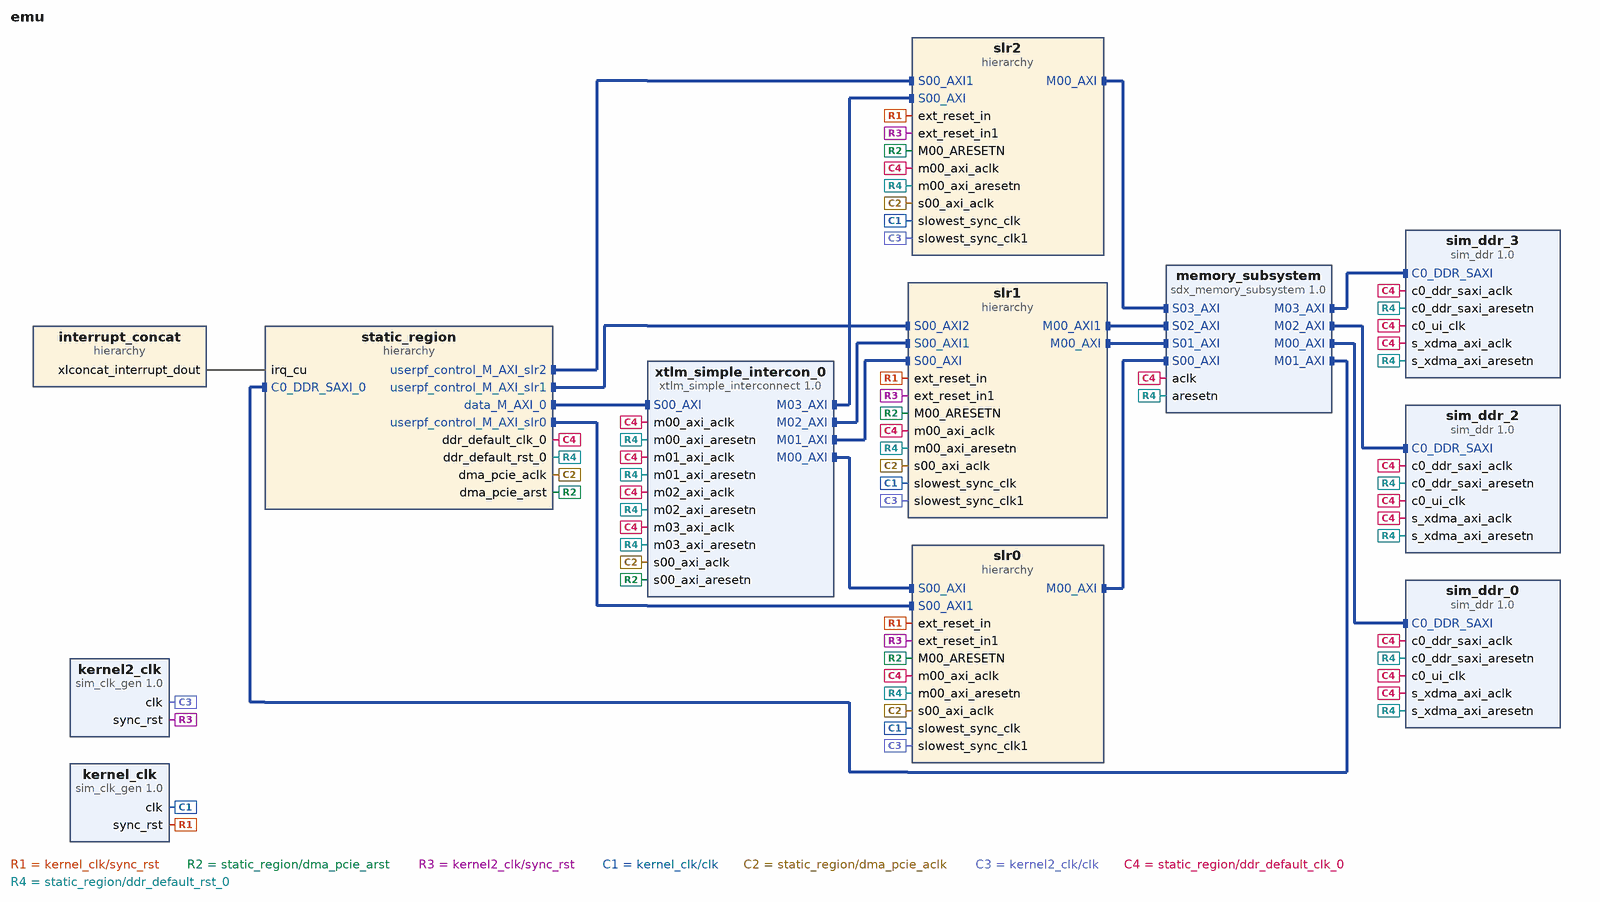
[diagram p0: block diagram of the top level]
# Vivado block design emu, xcu200-fsgd2104-2-e, Vivado 2018.3
create_bd_design emu

create_bd_cell -type hier static_region
create_bd_cell -type ip -vlnv xilinx.com:ip:sim_clk_gen:1.0 kernel2_clk
set_property -dict {CONFIG.FREQ_HZ 500000000} [get_bd_cells kernel2_clk]
create_bd_cell -type ip -vlnv xilinx.com:ip:sim_clk_gen:1.0 kernel_clk
set_property -dict {CONFIG.FREQ_HZ 300000000} [get_bd_cells kernel_clk]
create_bd_cell -type ip -vlnv xilinx.com:xilinx:xtlm_simple_interconnect:1.0 xtlm_simple_intercon_0
set_property -dict [list \
  CONFIG.C_ADDR_RANGES 2 \
  CONFIG.C_M00_A00_ADDR_RANGE {"0000000000000000000000000000001111111111111111111111111111111111"} \
  CONFIG.C_M00_A00_BASE_ADDRESS 0x0 \
  CONFIG.C_M00_A01_ADDR_RANGE 0x0000000000060000 \
  CONFIG.C_M00_A01_BASE_ADDRESS {"0000000000000000000000000001000000000000000000000000000000000000"} \
  CONFIG.C_M00_AXI_ADDR_WIDTH 64 \
  CONFIG.C_M00_AXI_DATA_WIDTH 32 \
  CONFIG.C_M01_A00_ADDR_RANGE {"0000000000000000000000000000001111111111111111111111111111111111"} \
  CONFIG.C_M01_A00_BASE_ADDRESS 0x0000000400000000 \
  CONFIG.C_M01_A01_ADDR_RANGE 0x0000000000060000 \
  CONFIG.C_M01_A01_BASE_ADDRESS {"0000000000000000000000000001000000000000000000000000000000000000"} \
  CONFIG.C_M01_AXI_ADDR_WIDTH 64 \
  CONFIG.C_M01_AXI_DATA_WIDTH 32 \
  CONFIG.C_M02_A00_ADDR_RANGE {"0000000000000000000000000000001111111111111111111111111111111111"} \
  CONFIG.C_M02_A00_BASE_ADDRESS 0x0000000800000000 \
  CONFIG.C_M02_A01_ADDR_RANGE 0x0000000000060000 \
  CONFIG.C_M02_A01_BASE_ADDRESS {"0000000000000000000000000001000000000000000000000000000000000000"} \
  CONFIG.C_M02_AXI_ADDR_WIDTH 64 \
  CONFIG.C_M02_AXI_DATA_WIDTH 32 \
  CONFIG.C_M03_A00_ADDR_RANGE {"0000000000000000000000000000001111111111111111111111111111111111"} \
  CONFIG.C_M03_A00_BASE_ADDRESS 0x0000000C00000000 \
  CONFIG.C_M03_A01_ADDR_RANGE 0x0000000000060000 \
  CONFIG.C_M03_A01_BASE_ADDRESS {"0000000000000000000000000001000000000000000000000000000000000000"} \
  CONFIG.C_M03_AXI_ADDR_WIDTH 64 \
  CONFIG.C_M03_AXI_DATA_WIDTH 32 \
  CONFIG.C_NUM_MI 4 \
  CONFIG.C_S00_AXI_ADDR_WIDTH 64 \
  CONFIG.C_S00_AXI_DATA_WIDTH 32 \
] [get_bd_cells xtlm_simple_intercon_0]
create_bd_cell -type ip -vlnv xilinx.com:ip:sdx_memory_subsystem:1.0 memory_subsystem
set_property -dict [list \
  CONFIG.ADVANCED_PROPERTIES {resource_map_replication {S00_AXI {} S01_AXI {} S02_AXI {} S03_AXI {}} plram_specifications {{ SIZE 128K AXI_DATA_WIDTH 512 SLR_ASSIGNMENT SLR0 } { SIZE 128K AXI_DATA_WIDTH 512 SLR_ASSIGNMENT SLR1 } { SIZE 128K AXI_DATA_WIDTH 512 SLR_ASSIGNMENT SLR2 }} resource_access_constraints {S00_AXI {M00_AXI_MEM00 PLRAM_MEM00 PLRAM_MEM01 PLRAM_MEM02} S01_AXI M01_AXI_MEM00 S02_AXI M02_AXI_MEM00 S03_AXI M03_AXI_MEM00} __temp_dsa_info {excluded_board_components {xilinx.com:au200:ddr4_sdram_c0:1.0 xilinx.com:au200:ddr4_sdram_c1:1.0 xilinx.com:au200:ddr4_sdram_c2:1.0 xilinx.com:au200:ddr4_sdram_c3:1.0} axi_passthrough {xilinx.com:au200:ddr4_sdram_c0:1.0 {offset 0x0 range 16G slr SLR0} xilinx.com:au200:ddr4_sdram_c1:1.0 {offset 0x400000000 range 16G slr SLR1} xilinx.com:au200:ddr4_sdram_c2:1.0 {offset 0x800000000 range 16G slr SLR1} xilinx.com:au200:ddr4_sdram_c3:1.0 {offset 0xc00000000 range 16G slr SLR2}} sim_props {ddr4_0 {offset 0x0 range 0x400000000 slr SLR0 passthrough yes} ddr4_1 {offset 0x400000000 range 0x400000000 slr SLR1 passthrough yes} ddr4_2 {offset 0x800000000 range 0x400000000 slr SLR1 passthrough yes} ddr4_3 {offset 0xc00000000 range 0x400000000 slr SLR2 passthrough yes} plram_0 {offset 0x1000000000 range 0x20000 slr SLR0 passthrough no} plram_1 {offset 0x1000020000 range 0x20000 slr SLR1 passthrough no} plram_2 {offset 0x1000040000 range 0x20000 slr SLR2 passthrough no}}}} \
  CONFIG.NUM_CLKS 1 \
  CONFIG.NUM_SI 4 \
] [get_bd_cells memory_subsystem]
create_bd_cell -type ip -vlnv xilinx.com:user:sim_ddr:1.0 sim_ddr_0
set_property -dict [list \
  CONFIG.C0_A00_BASE_ADDR 0x0 \
  CONFIG.C0_A00_HIGH_ADDR 0x0000000400000000 \
  CONFIG.C0_ADDR_WIDTH 17 \
  CONFIG.C0_APP_ADDR_WIDTH 31 \
  CONFIG.C0_APP_DATA_WIDTH 512 \
  CONFIG.C0_AXI_ADDR_WIDTH 34 \
  CONFIG.C0_AXI_ARBITRATION_SCHEME RD_PRI_REG \
  CONFIG.C0_AXI_DATA_WIDTH 512 \
  CONFIG.C0_AXI_ID_WIDTH 1 \
  CONFIG.C0_AutoPrecharge false \
  CONFIG.C0_AxiNarrowBurst false \
  CONFIG.C0_BANK_GROUP_WIDTH 2 \
  CONFIG.C0_BANK_WIDTH 2 \
  CONFIG.C0_BURST_LENGTH 8 \
  CONFIG.C0_CL 0 \
  CONFIG.C0_COLUMN_WIDTH 10 \
  CONFIG.C0_CWL 0 \
  CONFIG.C0_DATA_WIDTH 72 \
  CONFIG.C0_DDR_SAXI_ADDR_WIDTH 34 \
  CONFIG.C0_DDR_SAXI_BASEADDR 0x0000000000000000 \
  CONFIG.C0_DDR_SAXI_DATA_WIDTH 512 \
  CONFIG.C0_DDR_SAXI_HIGHADDR 0x0000000400000000 \
  CONFIG.C0_MEMORY_PART MTA18ASF2G72PZ-2G3 \
  CONFIG.C0_MEM_ADDR_MAP ROW_COLUMN_BANK \
  CONFIG.C0_Mem_Add_Map ROW_COLUMN_BANK \
  CONFIG.C0_NAME dynamic_region_memory_subsystem_memory_ddr4_mem00 \
  CONFIG.C0_Ordering Normal \
  CONFIG.C0_RANK_WIDTH 1 \
  CONFIG.C0_ROW_WIDTH 17 \
  CONFIG.C0_SIZE 16GB \
  CONFIG.C0_TIMEPERIOD_PS 833 \
  CONFIG.C0_TYPE ddr4 \
  CONFIG.C0_tCK 833 \
  CONFIG.C0_tCKE 0 \
  CONFIG.C0_tFAW 16 \
  CONFIG.C0_tMRD 2 \
  CONFIG.C0_tRAS 39 \
  CONFIG.C0_tRCD 17 \
  CONFIG.C0_tREFI 9363 \
  CONFIG.C0_tRFC 421 \
  CONFIG.C0_tRP 17 \
  CONFIG.C0_tRRD_L 6 \
  CONFIG.C0_tRRD_S 4 \
  CONFIG.C0_tRTP 10 \
  CONFIG.C0_tWR 19 \
  CONFIG.C0_tWTR_L 10 \
  CONFIG.C0_tWTR_S 4 \
  CONFIG.C0_tXPR 109 \
  CONFIG.C0_tZQCS 128 \
  CONFIG.C0_tZQI 0 \
  CONFIG.C0_tZQINIT 256 \
  CONFIG.C_NUMBER_OF_GLOBAL_MEMORIES 1 \
] [get_bd_cells sim_ddr_0]
create_bd_cell -type ip -vlnv xilinx.com:user:sim_ddr:1.0 sim_ddr_2
set_property -dict [list \
  CONFIG.C0_A00_BASE_ADDR 0x0 \
  CONFIG.C0_A00_HIGH_ADDR 0x0000000400000000 \
  CONFIG.C0_ADDR_WIDTH 17 \
  CONFIG.C0_APP_ADDR_WIDTH 31 \
  CONFIG.C0_APP_DATA_WIDTH 512 \
  CONFIG.C0_AXI_ADDR_WIDTH 34 \
  CONFIG.C0_AXI_ARBITRATION_SCHEME RD_PRI_REG \
  CONFIG.C0_AXI_DATA_WIDTH 512 \
  CONFIG.C0_AXI_ID_WIDTH 1 \
  CONFIG.C0_AutoPrecharge false \
  CONFIG.C0_AxiNarrowBurst false \
  CONFIG.C0_BANK_GROUP_WIDTH 2 \
  CONFIG.C0_BANK_WIDTH 2 \
  CONFIG.C0_BURST_LENGTH 8 \
  CONFIG.C0_CL 0 \
  CONFIG.C0_COLUMN_WIDTH 10 \
  CONFIG.C0_CWL 0 \
  CONFIG.C0_DATA_WIDTH 72 \
  CONFIG.C0_DDR_SAXI_ADDR_WIDTH 34 \
  CONFIG.C0_DDR_SAXI_BASEADDR 0x0000000000000000 \
  CONFIG.C0_DDR_SAXI_DATA_WIDTH 512 \
  CONFIG.C0_DDR_SAXI_HIGHADDR 0x0000000400000000 \
  CONFIG.C0_MEMORY_PART MTA18ASF2G72PZ-2G3 \
  CONFIG.C0_MEM_ADDR_MAP ROW_COLUMN_BANK \
  CONFIG.C0_Mem_Add_Map ROW_COLUMN_BANK \
  CONFIG.C0_NAME dynamic_region_memory_subsystem_memory_ddr4_mem01 \
  CONFIG.C0_Ordering Normal \
  CONFIG.C0_RANK_WIDTH 1 \
  CONFIG.C0_ROW_WIDTH 17 \
  CONFIG.C0_SIZE 16GB \
  CONFIG.C0_TIMEPERIOD_PS 833 \
  CONFIG.C0_TYPE ddr4 \
  CONFIG.C0_tCK 833 \
  CONFIG.C0_tCKE 0 \
  CONFIG.C0_tFAW 16 \
  CONFIG.C0_tMRD 2 \
  CONFIG.C0_tRAS 39 \
  CONFIG.C0_tRCD 17 \
  CONFIG.C0_tREFI 9363 \
  CONFIG.C0_tRFC 421 \
  CONFIG.C0_tRP 17 \
  CONFIG.C0_tRRD_L 6 \
  CONFIG.C0_tRRD_S 4 \
  CONFIG.C0_tRTP 10 \
  CONFIG.C0_tWR 19 \
  CONFIG.C0_tWTR_L 10 \
  CONFIG.C0_tWTR_S 4 \
  CONFIG.C0_tXPR 109 \
  CONFIG.C0_tZQCS 128 \
  CONFIG.C0_tZQI 0 \
  CONFIG.C0_tZQINIT 256 \
  CONFIG.C_NUMBER_OF_GLOBAL_MEMORIES 1 \
] [get_bd_cells sim_ddr_2]
create_bd_cell -type ip -vlnv xilinx.com:user:sim_ddr:1.0 sim_ddr_3
set_property -dict [list \
  CONFIG.C0_A00_BASE_ADDR 0x0 \
  CONFIG.C0_A00_HIGH_ADDR 0x0000000400000000 \
  CONFIG.C0_ADDR_WIDTH 17 \
  CONFIG.C0_APP_ADDR_WIDTH 31 \
  CONFIG.C0_APP_DATA_WIDTH 512 \
  CONFIG.C0_AXI_ADDR_WIDTH 34 \
  CONFIG.C0_AXI_ARBITRATION_SCHEME RD_PRI_REG \
  CONFIG.C0_AXI_DATA_WIDTH 512 \
  CONFIG.C0_AXI_ID_WIDTH 1 \
  CONFIG.C0_AutoPrecharge false \
  CONFIG.C0_AxiNarrowBurst false \
  CONFIG.C0_BANK_GROUP_WIDTH 2 \
  CONFIG.C0_BANK_WIDTH 2 \
  CONFIG.C0_BURST_LENGTH 8 \
  CONFIG.C0_CL 0 \
  CONFIG.C0_COLUMN_WIDTH 10 \
  CONFIG.C0_CWL 0 \
  CONFIG.C0_DATA_WIDTH 72 \
  CONFIG.C0_DDR_SAXI_ADDR_WIDTH 34 \
  CONFIG.C0_DDR_SAXI_BASEADDR 0x0000000000000000 \
  CONFIG.C0_DDR_SAXI_DATA_WIDTH 512 \
  CONFIG.C0_DDR_SAXI_HIGHADDR 0x0000000400000000 \
  CONFIG.C0_MEMORY_PART MTA18ASF2G72PZ-2G3 \
  CONFIG.C0_MEM_ADDR_MAP ROW_COLUMN_BANK \
  CONFIG.C0_Mem_Add_Map ROW_COLUMN_BANK \
  CONFIG.C0_NAME dynamic_region_memory_subsystem_memory_ddr4_mem02 \
  CONFIG.C0_Ordering Normal \
  CONFIG.C0_RANK_WIDTH 1 \
  CONFIG.C0_ROW_WIDTH 17 \
  CONFIG.C0_SIZE 16GB \
  CONFIG.C0_TIMEPERIOD_PS 833 \
  CONFIG.C0_TYPE ddr4 \
  CONFIG.C0_tCK 833 \
  CONFIG.C0_tCKE 0 \
  CONFIG.C0_tFAW 16 \
  CONFIG.C0_tMRD 2 \
  CONFIG.C0_tRAS 39 \
  CONFIG.C0_tRCD 17 \
  CONFIG.C0_tREFI 9363 \
  CONFIG.C0_tRFC 421 \
  CONFIG.C0_tRP 17 \
  CONFIG.C0_tRRD_L 6 \
  CONFIG.C0_tRRD_S 4 \
  CONFIG.C0_tRTP 10 \
  CONFIG.C0_tWR 19 \
  CONFIG.C0_tWTR_L 10 \
  CONFIG.C0_tWTR_S 4 \
  CONFIG.C0_tXPR 109 \
  CONFIG.C0_tZQCS 128 \
  CONFIG.C0_tZQI 0 \
  CONFIG.C0_tZQINIT 256 \
  CONFIG.C_NUMBER_OF_GLOBAL_MEMORIES 1 \
] [get_bd_cells sim_ddr_3]
create_bd_cell -type hier slr0
create_bd_cell -type hier slr1
create_bd_cell -type hier slr2
create_bd_cell -type hier interrupt_concat

# ---- hierarchy /static_region ----
current_bd_instance /static_region
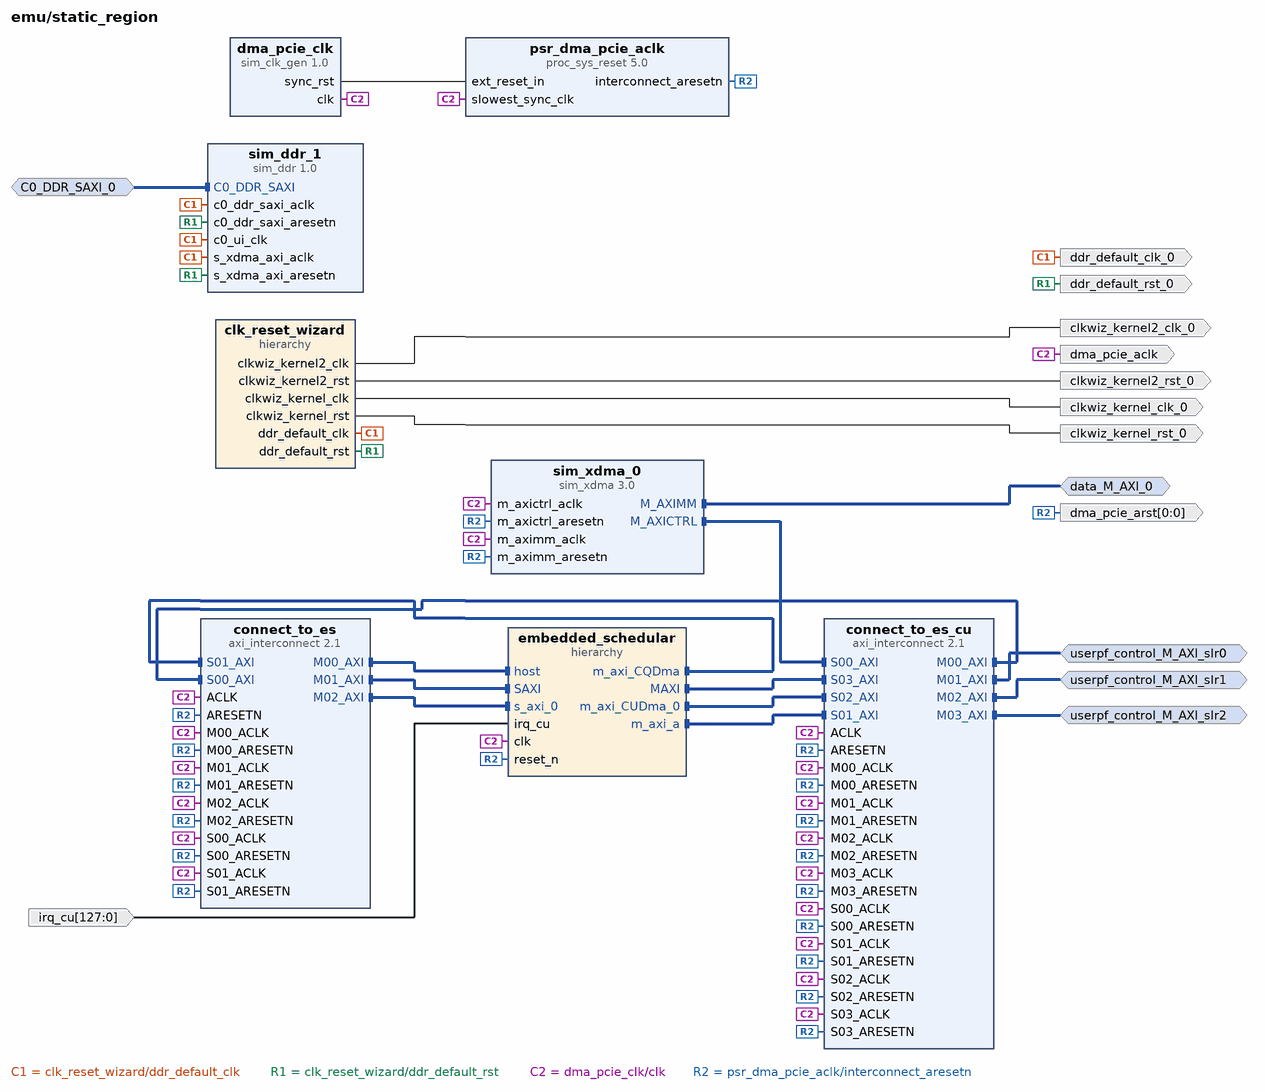
[diagram p1: block diagram inside /static_region]
create_bd_intf_pin -mode Slave -vlnv xilinx.com:interface:aximm_rtl:1.0 C0_DDR_SAXI_0
create_bd_intf_pin -mode Master -vlnv xilinx.com:interface:aximm_rtl:1.0 data_M_AXI_0
create_bd_intf_pin -mode Master -vlnv xilinx.com:interface:aximm_rtl:1.0 userpf_control_M_AXI_slr0
create_bd_intf_pin -mode Master -vlnv xilinx.com:interface:aximm_rtl:1.0 userpf_control_M_AXI_slr1
create_bd_intf_pin -mode Master -vlnv xilinx.com:interface:aximm_rtl:1.0 userpf_control_M_AXI_slr2
create_bd_pin -dir O -type clk clkwiz_kernel2_clk_0
create_bd_pin -dir O -type clk clkwiz_kernel_clk_0
create_bd_pin -dir O -type rst clkwiz_kernel2_rst_0
create_bd_pin -dir O -type rst clkwiz_kernel_rst_0
create_bd_pin -dir O -type clk ddr_default_clk_0
create_bd_pin -dir O -type rst ddr_default_rst_0
create_bd_pin -dir O -type clk dma_pcie_aclk
create_bd_pin -dir I -from 127 -to 0 irq_cu
create_bd_pin -dir O -from 0 -to 0 -type rst dma_pcie_arst

create_bd_cell -type hier clk_reset_wizard
create_bd_cell -type ip -vlnv xilinx.com:ip:axi_interconnect:2.1 connect_to_es
set_property -dict {CONFIG.NUM_MI 3 CONFIG.NUM_SI 2} [get_bd_cells connect_to_es]
create_bd_cell -type ip -vlnv xilinx.com:ip:axi_interconnect:2.1 connect_to_es_cu
set_property -dict {CONFIG.NUM_MI 4 CONFIG.NUM_SI 4} [get_bd_cells connect_to_es_cu]
create_bd_cell -type ip -vlnv xilinx.com:ip:sim_clk_gen:1.0 dma_pcie_clk
set_property -dict {CONFIG.FREQ_HZ 300000000.0} [get_bd_cells dma_pcie_clk]
create_bd_cell -type hier embedded_schedular
create_bd_cell -type ip -vlnv xilinx.com:ip:proc_sys_reset:5.0 psr_dma_pcie_aclk
create_bd_cell -type ip -vlnv xilinx.com:user:sim_ddr:1.0 sim_ddr_1
set_property -dict [list \
  CONFIG.C0_A00_BASE_ADDR 0x0 \
  CONFIG.C0_A00_HIGH_ADDR 0x0000000400000000 \
  CONFIG.C0_ADDR_WIDTH 17 \
  CONFIG.C0_APP_ADDR_WIDTH 31 \
  CONFIG.C0_APP_DATA_WIDTH 512 \
  CONFIG.C0_AXI_ADDR_WIDTH 34 \
  CONFIG.C0_AXI_ARBITRATION_SCHEME RD_PRI_REG \
  CONFIG.C0_AXI_DATA_WIDTH 512 \
  CONFIG.C0_AXI_ID_WIDTH 1 \
  CONFIG.C0_AutoPrecharge false \
  CONFIG.C0_AxiNarrowBurst false \
  CONFIG.C0_BANK_GROUP_WIDTH 2 \
  CONFIG.C0_BANK_WIDTH 2 \
  CONFIG.C0_BURST_LENGTH 8 \
  CONFIG.C0_CL 0 \
  CONFIG.C0_COLUMN_WIDTH 10 \
  CONFIG.C0_CWL 0 \
  CONFIG.C0_DATA_WIDTH 72 \
  CONFIG.C0_DDR_SAXI_ADDR_WIDTH 34 \
  CONFIG.C0_DDR_SAXI_BASEADDR 0x0000000000000000 \
  CONFIG.C0_DDR_SAXI_DATA_WIDTH 512 \
  CONFIG.C0_DDR_SAXI_HIGHADDR 0x0000000400000000 \
  CONFIG.C0_MEMORY_PART MTA18ASF2G72PZ-2G3 \
  CONFIG.C0_MEM_ADDR_MAP ROW_COLUMN_BANK \
  CONFIG.C0_Mem_Add_Map ROW_COLUMN_BANK \
  CONFIG.C0_NAME static_region_slr1_memc_ddrmem_1 \
  CONFIG.C0_Ordering Normal \
  CONFIG.C0_RANK_WIDTH 1 \
  CONFIG.C0_ROW_WIDTH 17 \
  CONFIG.C0_SIZE 16GB \
  CONFIG.C0_TIMEPERIOD_PS 833 \
  CONFIG.C0_TYPE ddr4 \
  CONFIG.C0_tCK 833 \
  CONFIG.C0_tCKE 0 \
  CONFIG.C0_tFAW 16 \
  CONFIG.C0_tMRD 2 \
  CONFIG.C0_tRAS 39 \
  CONFIG.C0_tRCD 17 \
  CONFIG.C0_tREFI 9363 \
  CONFIG.C0_tRFC 421 \
  CONFIG.C0_tRP 17 \
  CONFIG.C0_tRRD_L 6 \
  CONFIG.C0_tRRD_S 4 \
  CONFIG.C0_tRTP 10 \
  CONFIG.C0_tWR 19 \
  CONFIG.C0_tWTR_L 10 \
  CONFIG.C0_tWTR_S 4 \
  CONFIG.C0_tXPR 109 \
  CONFIG.C0_tZQCS 128 \
  CONFIG.C0_tZQI 0 \
  CONFIG.C0_tZQINIT 256 \
  CONFIG.C_NUMBER_OF_GLOBAL_MEMORIES 1 \
] [get_bd_cells sim_ddr_1]
create_bd_cell -type ip -vlnv xilinx.com:xilinx:sim_xdma:3.0 sim_xdma_0
set_property -dict [list \
  CONFIG.C_M_AXICTRL_ADDR_WIDTH 64 \
  CONFIG.C_M_AXICTRL_DATA_WIDTH 32 \
  CONFIG.C_M_AXIMM_ADDR_WIDTH 64 \
  CONFIG.C_M_AXIMM_ARUSER_WIDTH 32 \
  CONFIG.C_M_AXIMM_AWUSER_WIDTH 32 \
  CONFIG.C_M_AXIMM_DATA_WIDTH 32 \
] [get_bd_cells sim_xdma_0]

# ---- hierarchy /static_region/clk_reset_wizard ----
current_bd_instance /static_region/clk_reset_wizard
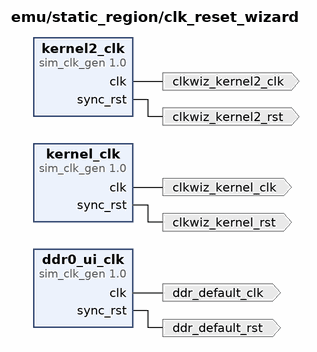
[diagram p2: block diagram inside /static_region/clk_reset_wizard]
create_bd_pin -dir O -type rst clkwiz_kernel2_rst
create_bd_pin -dir O -type rst clkwiz_kernel_rst
create_bd_pin -dir O -type clk ddr_default_clk
create_bd_pin -dir O -type rst ddr_default_rst
create_bd_pin -dir O -type clk clkwiz_kernel2_clk
create_bd_pin -dir O -type clk clkwiz_kernel_clk

create_bd_cell -type ip -vlnv xilinx.com:ip:sim_clk_gen:1.0 ddr0_ui_clk
set_property -dict {CONFIG.FREQ_HZ 300120048} [get_bd_cells ddr0_ui_clk]
create_bd_cell -type ip -vlnv xilinx.com:ip:sim_clk_gen:1.0 kernel2_clk
set_property -dict {CONFIG.FREQ_HZ 500000000} [get_bd_cells kernel2_clk]
create_bd_cell -type ip -vlnv xilinx.com:ip:sim_clk_gen:1.0 kernel_clk
set_property -dict {CONFIG.FREQ_HZ 300000000} [get_bd_cells kernel_clk]

# ---- hierarchy /static_region/embedded_schedular ----
current_bd_instance /static_region/embedded_schedular
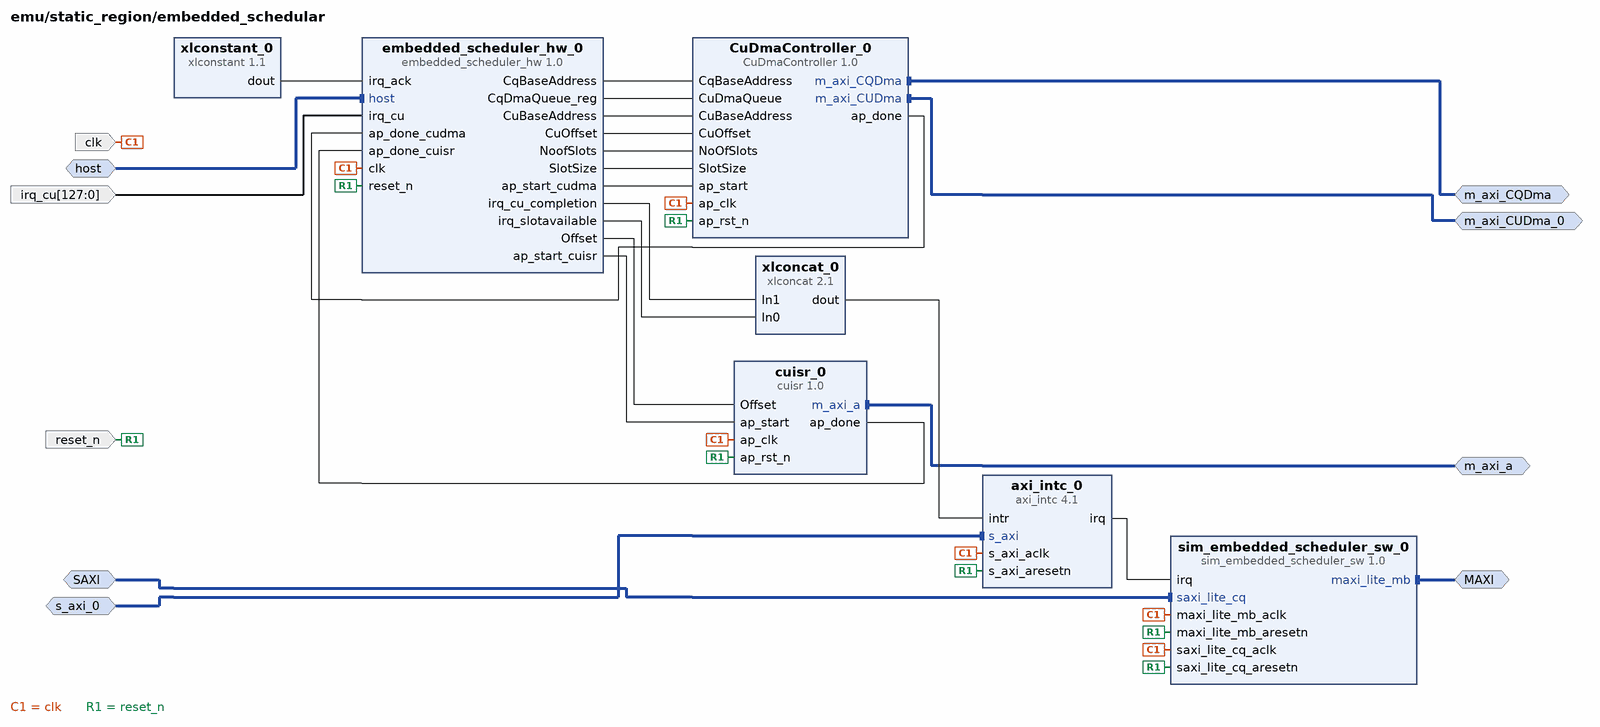
[diagram p3: block diagram inside /static_region/embedded_schedular]
create_bd_intf_pin -mode Master -vlnv xilinx.com:interface:aximm_rtl:1.0 MAXI
create_bd_intf_pin -mode Slave -vlnv xilinx.com:interface:aximm_rtl:1.0 SAXI
create_bd_intf_pin -mode Slave -vlnv xilinx.com:interface:aximm_rtl:1.0 host
create_bd_intf_pin -mode Master -vlnv xilinx.com:interface:aximm_rtl:1.0 m_axi_CQDma
create_bd_intf_pin -mode Master -vlnv xilinx.com:interface:aximm_rtl:1.0 m_axi_CUDma_0
create_bd_intf_pin -mode Master -vlnv xilinx.com:interface:aximm_rtl:1.0 m_axi_a
create_bd_intf_pin -mode Slave -vlnv xilinx.com:interface:aximm_rtl:1.0 s_axi_0
create_bd_pin -dir I -type clk clk
create_bd_pin -dir I -from 127 -to 0 irq_cu
create_bd_pin -dir I -type rst reset_n

create_bd_cell -type ip -vlnv xilinx:hls:CuDmaController:1.0 CuDmaController_0
create_bd_cell -type ip -vlnv xilinx.com:ip:axi_intc:4.1 axi_intc_0
set_property -dict [list \
  CONFIG.C_HAS_FAST 0 \
  CONFIG.C_IRQ_ACTIVE 1 \
  CONFIG.C_IRQ_IS_LEVEL 1 \
  CONFIG.C_KIND_OF_INTR 0xFFFFFFFC \
  CONFIG.C_KIND_OF_LVL 0xFFFFFFFF \
] [get_bd_cells axi_intc_0]
create_bd_cell -type ip -vlnv xilinx:hls:cuisr:1.0 cuisr_0
create_bd_cell -type ip -vlnv xilinx.com:user:embedded_scheduler_hw:1.0 embedded_scheduler_hw_0
create_bd_cell -type ip -vlnv xilinx.com:xilinx:sim_embedded_scheduler_sw:1.0 sim_embedded_scheduler_sw_0
create_bd_cell -type ip -vlnv xilinx.com:ip:xlconcat:2.1 xlconcat_0
create_bd_cell -type ip -vlnv xilinx.com:ip:xlconstant:1.1 xlconstant_0
set_property -dict {CONFIG.CONST_VAL 0 CONFIG.CONST_WIDTH 16} [get_bd_cells xlconstant_0]

# ---- hierarchy /slr0 ----
current_bd_instance /slr0
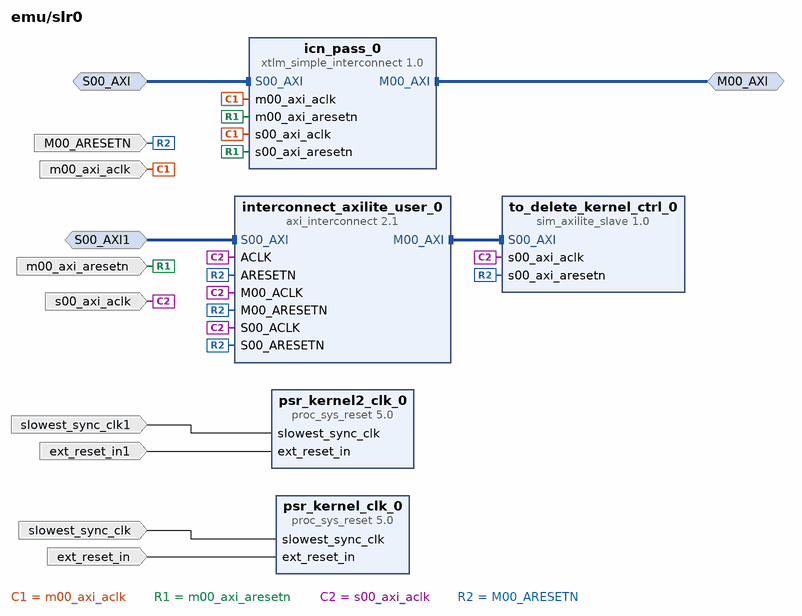
[diagram p4: block diagram inside /slr0]
create_bd_intf_pin -mode Slave -vlnv xilinx.com:interface:aximm_rtl:1.0 S00_AXI
create_bd_intf_pin -mode Master -vlnv xilinx.com:interface:aximm_rtl:1.0 M00_AXI
create_bd_intf_pin -mode Slave -vlnv xilinx.com:interface:aximm_rtl:1.0 S00_AXI1
create_bd_pin -dir I -type clk m00_axi_aclk
create_bd_pin -dir I -type rst m00_axi_aresetn
create_bd_pin -dir I -type clk slowest_sync_clk
create_bd_pin -dir I -type rst ext_reset_in
create_bd_pin -dir I -type clk slowest_sync_clk1
create_bd_pin -dir I -type rst ext_reset_in1
create_bd_pin -dir I -type clk s00_axi_aclk
create_bd_pin -dir I -type rst M00_ARESETN

create_bd_cell -type ip -vlnv xilinx.com:xilinx:xtlm_simple_interconnect:1.0 icn_pass_0
set_property -dict [list \
  CONFIG.C_M00_AXI_ADDR_WIDTH 64 \
  CONFIG.C_NUM_MI 1 \
  CONFIG.C_NUM_SI 1 \
  CONFIG.SLR_ASSIGNMENTS SLR0 \
] [get_bd_cells icn_pass_0]
create_bd_cell -type ip -vlnv xilinx.com:ip:proc_sys_reset:5.0 psr_kernel_clk_0
set_property -dict {CONFIG.SLR_ASSIGNMENTS SLR0} [get_bd_cells psr_kernel_clk_0]
create_bd_cell -type ip -vlnv xilinx.com:ip:proc_sys_reset:5.0 psr_kernel2_clk_0
set_property -dict {CONFIG.SLR_ASSIGNMENTS SLR0} [get_bd_cells psr_kernel2_clk_0]
create_bd_cell -type ip -vlnv xilinx.com:ip:axi_interconnect:2.1 interconnect_axilite_user_0
set_property -dict [list \
  CONFIG.M01_HAS_REGSLICE 1 \
  CONFIG.NUM_MI 1 \
  CONFIG.NUM_SI 1 \
  CONFIG.SLR_ASSIGNMENTS SLR0 \
] [get_bd_cells interconnect_axilite_user_0]
create_bd_cell -type ip -vlnv xilinx.com:user:sim_axilite_slave:1.0 to_delete_kernel_ctrl_0
set_property -dict {CONFIG.SLR_ASSIGNMENTS SLR0} [get_bd_cells to_delete_kernel_ctrl_0]

# ---- hierarchy /slr1 ----
current_bd_instance /slr1
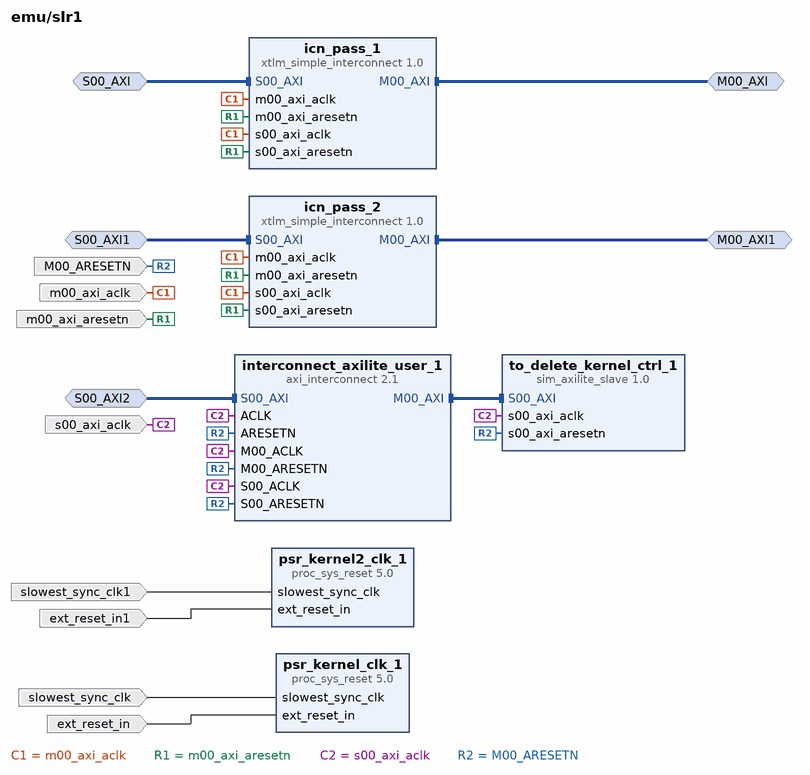
[diagram p5: block diagram inside /slr1]
create_bd_intf_pin -mode Slave -vlnv xilinx.com:interface:aximm_rtl:1.0 S00_AXI
create_bd_intf_pin -mode Master -vlnv xilinx.com:interface:aximm_rtl:1.0 M00_AXI
create_bd_intf_pin -mode Slave -vlnv xilinx.com:interface:aximm_rtl:1.0 S00_AXI1
create_bd_intf_pin -mode Master -vlnv xilinx.com:interface:aximm_rtl:1.0 M00_AXI1
create_bd_intf_pin -mode Slave -vlnv xilinx.com:interface:aximm_rtl:1.0 S00_AXI2
create_bd_pin -dir I -type clk m00_axi_aclk
create_bd_pin -dir I -type rst m00_axi_aresetn
create_bd_pin -dir I -type clk slowest_sync_clk
create_bd_pin -dir I -type rst ext_reset_in
create_bd_pin -dir I -type clk slowest_sync_clk1
create_bd_pin -dir I -type rst ext_reset_in1
create_bd_pin -dir I -type clk s00_axi_aclk
create_bd_pin -dir I -type rst M00_ARESETN

create_bd_cell -type ip -vlnv xilinx.com:xilinx:xtlm_simple_interconnect:1.0 icn_pass_1
set_property -dict [list \
  CONFIG.C_M00_AXI_ADDR_WIDTH 64 \
  CONFIG.C_NUM_MI 1 \
  CONFIG.C_NUM_SI 1 \
  CONFIG.SLR_ASSIGNMENTS SLR1 \
] [get_bd_cells icn_pass_1]
create_bd_cell -type ip -vlnv xilinx.com:xilinx:xtlm_simple_interconnect:1.0 icn_pass_2
set_property -dict [list \
  CONFIG.C_M00_AXI_ADDR_WIDTH 64 \
  CONFIG.C_NUM_MI 1 \
  CONFIG.C_NUM_SI 1 \
  CONFIG.SLR_ASSIGNMENTS SLR1 \
] [get_bd_cells icn_pass_2]
create_bd_cell -type ip -vlnv xilinx.com:ip:proc_sys_reset:5.0 psr_kernel_clk_1
set_property -dict {CONFIG.SLR_ASSIGNMENTS SLR1} [get_bd_cells psr_kernel_clk_1]
create_bd_cell -type ip -vlnv xilinx.com:ip:proc_sys_reset:5.0 psr_kernel2_clk_1
set_property -dict {CONFIG.SLR_ASSIGNMENTS SLR1} [get_bd_cells psr_kernel2_clk_1]
create_bd_cell -type ip -vlnv xilinx.com:ip:axi_interconnect:2.1 interconnect_axilite_user_1
set_property -dict [list \
  CONFIG.M01_HAS_REGSLICE 1 \
  CONFIG.NUM_MI 1 \
  CONFIG.NUM_SI 1 \
  CONFIG.SLR_ASSIGNMENTS SLR1 \
] [get_bd_cells interconnect_axilite_user_1]
create_bd_cell -type ip -vlnv xilinx.com:user:sim_axilite_slave:1.0 to_delete_kernel_ctrl_1
set_property -dict {CONFIG.SLR_ASSIGNMENTS SLR1} [get_bd_cells to_delete_kernel_ctrl_1]

# ---- hierarchy /slr2 ----
current_bd_instance /slr2
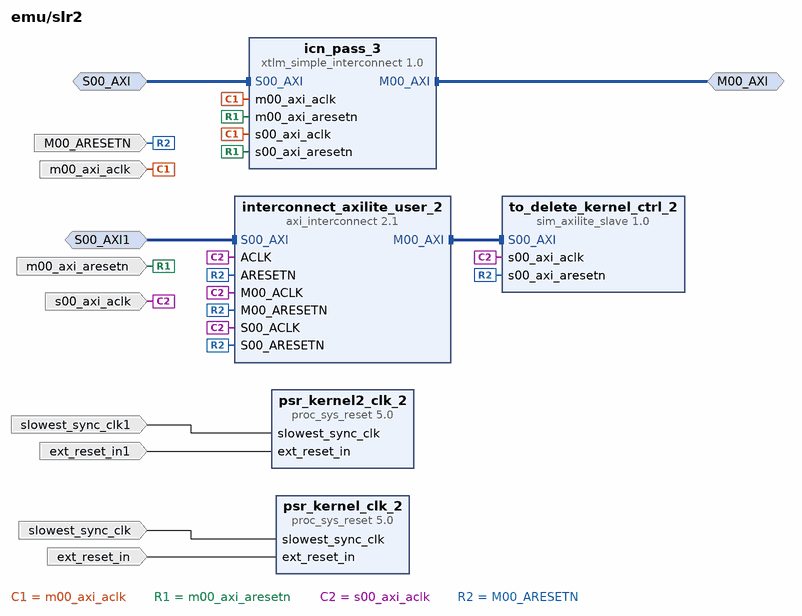
[diagram p6: block diagram inside /slr2]
create_bd_intf_pin -mode Slave -vlnv xilinx.com:interface:aximm_rtl:1.0 S00_AXI
create_bd_intf_pin -mode Master -vlnv xilinx.com:interface:aximm_rtl:1.0 M00_AXI
create_bd_intf_pin -mode Slave -vlnv xilinx.com:interface:aximm_rtl:1.0 S00_AXI1
create_bd_pin -dir I -type clk m00_axi_aclk
create_bd_pin -dir I -type rst m00_axi_aresetn
create_bd_pin -dir I -type clk slowest_sync_clk
create_bd_pin -dir I -type rst ext_reset_in
create_bd_pin -dir I -type clk slowest_sync_clk1
create_bd_pin -dir I -type rst ext_reset_in1
create_bd_pin -dir I -type clk s00_axi_aclk
create_bd_pin -dir I -type rst M00_ARESETN

create_bd_cell -type ip -vlnv xilinx.com:xilinx:xtlm_simple_interconnect:1.0 icn_pass_3
set_property -dict [list \
  CONFIG.C_M00_AXI_ADDR_WIDTH 64 \
  CONFIG.C_NUM_MI 1 \
  CONFIG.C_NUM_SI 1 \
  CONFIG.SLR_ASSIGNMENTS SLR2 \
] [get_bd_cells icn_pass_3]
create_bd_cell -type ip -vlnv xilinx.com:ip:proc_sys_reset:5.0 psr_kernel_clk_2
set_property -dict {CONFIG.SLR_ASSIGNMENTS SLR2} [get_bd_cells psr_kernel_clk_2]
create_bd_cell -type ip -vlnv xilinx.com:ip:proc_sys_reset:5.0 psr_kernel2_clk_2
set_property -dict {CONFIG.SLR_ASSIGNMENTS SLR2} [get_bd_cells psr_kernel2_clk_2]
create_bd_cell -type ip -vlnv xilinx.com:ip:axi_interconnect:2.1 interconnect_axilite_user_2
set_property -dict [list \
  CONFIG.M01_HAS_REGSLICE 1 \
  CONFIG.NUM_MI 1 \
  CONFIG.NUM_SI 1 \
  CONFIG.SLR_ASSIGNMENTS SLR2 \
] [get_bd_cells interconnect_axilite_user_2]
create_bd_cell -type ip -vlnv xilinx.com:user:sim_axilite_slave:1.0 to_delete_kernel_ctrl_2
set_property -dict {CONFIG.SLR_ASSIGNMENTS SLR2} [get_bd_cells to_delete_kernel_ctrl_2]

# ---- hierarchy /interrupt_concat ----
current_bd_instance /interrupt_concat
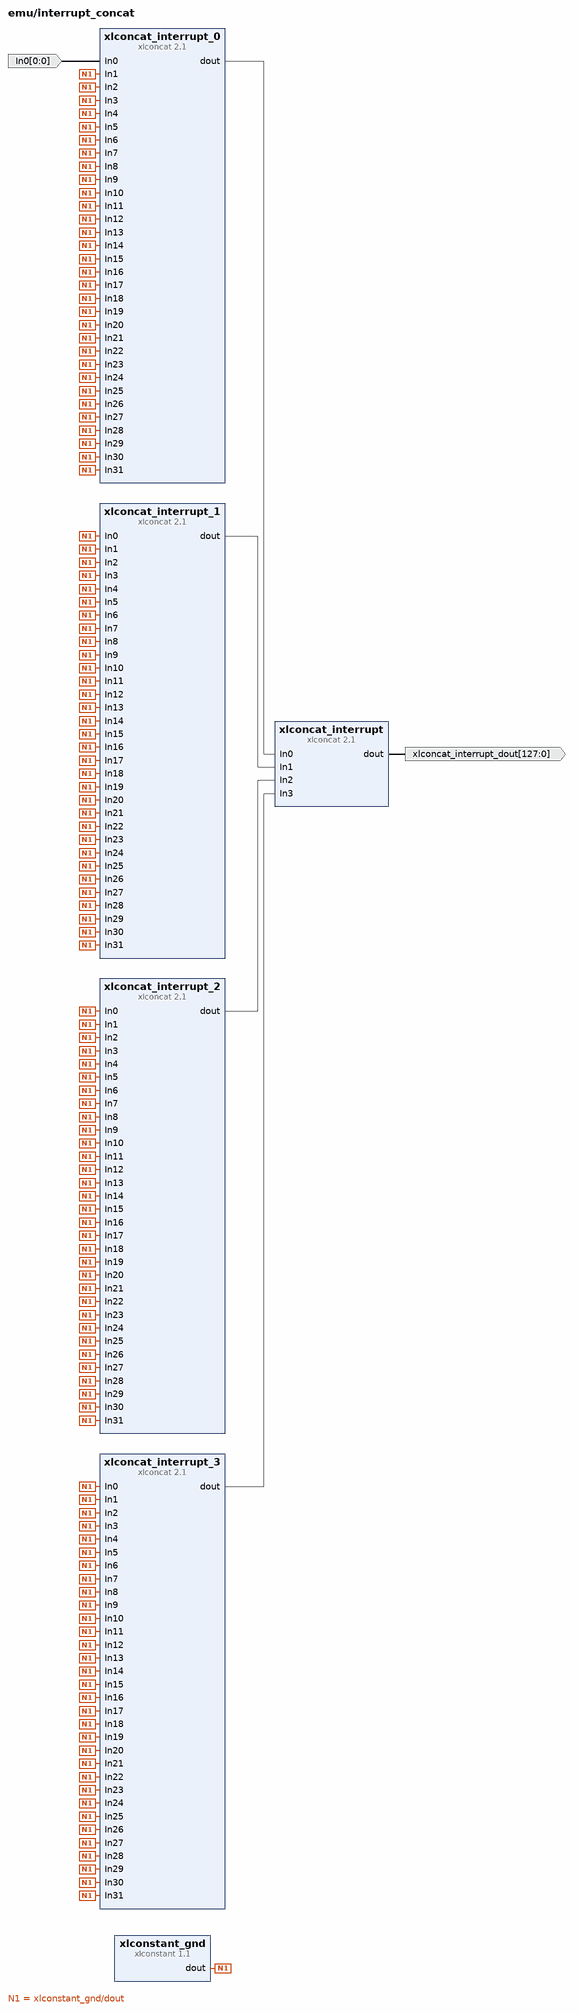
[diagram p7: block diagram inside /interrupt_concat]
create_bd_pin -dir I -from 0 -to 0 In0
create_bd_pin -dir O -from 127 -to 0 xlconcat_interrupt_dout

create_bd_cell -type ip -vlnv xilinx.com:ip:xlconcat:2.1 xlconcat_interrupt
set_property -dict {CONFIG.NUM_PORTS 4} [get_bd_cells xlconcat_interrupt]
create_bd_cell -type ip -vlnv xilinx.com:ip:xlconcat:2.1 xlconcat_interrupt_0
set_property -dict {CONFIG.NUM_PORTS 32} [get_bd_cells xlconcat_interrupt_0]
create_bd_cell -type ip -vlnv xilinx.com:ip:xlconcat:2.1 xlconcat_interrupt_1
set_property -dict {CONFIG.NUM_PORTS 32} [get_bd_cells xlconcat_interrupt_1]
create_bd_cell -type ip -vlnv xilinx.com:ip:xlconcat:2.1 xlconcat_interrupt_2
set_property -dict {CONFIG.NUM_PORTS 32} [get_bd_cells xlconcat_interrupt_2]
create_bd_cell -type ip -vlnv xilinx.com:ip:xlconcat:2.1 xlconcat_interrupt_3
set_property -dict {CONFIG.NUM_PORTS 32} [get_bd_cells xlconcat_interrupt_3]
create_bd_cell -type ip -vlnv xilinx.com:ip:xlconstant:1.1 xlconstant_gnd
set_property -dict {CONFIG.CONST_VAL 0} [get_bd_cells xlconstant_gnd]

# ---- connections ----

current_bd_instance /static_region
connect_bd_intf_net [get_bd_intf_pins connect_to_es/M00_AXI] [get_bd_intf_pins embedded_schedular/host]
connect_bd_intf_net -intf_net data_M_AXI_0_1_conn [get_bd_intf_pins data_M_AXI_0] [get_bd_intf_pins sim_xdma_0/M_AXIMM]
connect_bd_intf_net [get_bd_intf_pins connect_to_es/M01_AXI] [get_bd_intf_pins embedded_schedular/SAXI]
connect_bd_intf_net [get_bd_intf_pins userpf_control_M_AXI_slr2] [get_bd_intf_pins connect_to_es_cu/M03_AXI]
connect_bd_intf_net [get_bd_intf_pins connect_to_es/S01_AXI] [get_bd_intf_pins embedded_schedular/m_axi_CQDma]
connect_bd_intf_net [get_bd_intf_pins userpf_control_M_AXI_slr0] [get_bd_intf_pins connect_to_es_cu/M01_AXI]
connect_bd_intf_net [get_bd_intf_pins connect_to_es_cu/S03_AXI] [get_bd_intf_pins embedded_schedular/MAXI]
connect_bd_intf_net [get_bd_intf_pins connect_to_es/M02_AXI] [get_bd_intf_pins embedded_schedular/s_axi_0]
connect_bd_intf_net [get_bd_intf_pins connect_to_es/S00_AXI] [get_bd_intf_pins connect_to_es_cu/M00_AXI]
connect_bd_intf_net [get_bd_intf_pins userpf_control_M_AXI_slr1] [get_bd_intf_pins connect_to_es_cu/M02_AXI]
connect_bd_intf_net [get_bd_intf_pins connect_to_es_cu/S02_AXI] [get_bd_intf_pins embedded_schedular/m_axi_CUDma_0]
connect_bd_intf_net [get_bd_intf_pins connect_to_es_cu/S00_AXI] [get_bd_intf_pins sim_xdma_0/M_AXICTRL]
connect_bd_intf_net [get_bd_intf_pins connect_to_es_cu/S01_AXI] [get_bd_intf_pins embedded_schedular/m_axi_a]
connect_bd_intf_net [get_bd_intf_pins C0_DDR_SAXI_0] [get_bd_intf_pins sim_ddr_1/C0_DDR_SAXI]
connect_bd_net [get_bd_pins clk_reset_wizard/clkwiz_kernel2_clk] [get_bd_pins clkwiz_kernel2_clk_0]
connect_bd_net [get_bd_pins clk_reset_wizard/clkwiz_kernel_clk] [get_bd_pins clkwiz_kernel_clk_0]
connect_bd_net [get_bd_pins clk_reset_wizard/clkwiz_kernel2_rst] [get_bd_pins clkwiz_kernel2_rst_0]
connect_bd_net [get_bd_pins clk_reset_wizard/clkwiz_kernel_rst] [get_bd_pins clkwiz_kernel_rst_0]
connect_bd_net [get_bd_pins clk_reset_wizard/ddr_default_clk] \
  [get_bd_pins ddr_default_clk_0] [get_bd_pins sim_ddr_1/c0_ddr_saxi_aclk] [get_bd_pins sim_ddr_1/c0_ui_clk] \
  [get_bd_pins sim_ddr_1/s_xdma_axi_aclk]
connect_bd_net [get_bd_pins clk_reset_wizard/ddr_default_rst] \
  [get_bd_pins ddr_default_rst_0] [get_bd_pins sim_ddr_1/c0_ddr_saxi_aresetn] [get_bd_pins sim_ddr_1/s_xdma_axi_aresetn]
connect_bd_net -net pcie_dma_aclk [get_bd_pins dma_pcie_clk/clk] \
  [get_bd_pins dma_pcie_aclk] [get_bd_pins connect_to_es/ACLK] [get_bd_pins connect_to_es/M00_ACLK] \
  [get_bd_pins connect_to_es/M01_ACLK] [get_bd_pins connect_to_es/M02_ACLK] [get_bd_pins connect_to_es/S00_ACLK] \
  [get_bd_pins connect_to_es/S01_ACLK] [get_bd_pins connect_to_es_cu/ACLK] [get_bd_pins connect_to_es_cu/M00_ACLK] \
  [get_bd_pins connect_to_es_cu/M01_ACLK] [get_bd_pins connect_to_es_cu/M02_ACLK] [get_bd_pins connect_to_es_cu/M03_ACLK] \
  [get_bd_pins connect_to_es_cu/S00_ACLK] [get_bd_pins connect_to_es_cu/S01_ACLK] [get_bd_pins connect_to_es_cu/S02_ACLK] \
  [get_bd_pins connect_to_es_cu/S03_ACLK] [get_bd_pins embedded_schedular/clk] \
  [get_bd_pins psr_dma_pcie_aclk/slowest_sync_clk] [get_bd_pins sim_xdma_0/m_axictrl_aclk] \
  [get_bd_pins sim_xdma_0/m_aximm_aclk]
connect_bd_net -net pcie_dma [get_bd_pins dma_pcie_clk/sync_rst] [get_bd_pins psr_dma_pcie_aclk/ext_reset_in]
connect_bd_net [get_bd_pins irq_cu] [get_bd_pins embedded_schedular/irq_cu]
connect_bd_net -net psr_dma_pcie_aclk_mb_reset [get_bd_pins psr_dma_pcie_aclk/interconnect_aresetn] \
  [get_bd_pins dma_pcie_arst] [get_bd_pins connect_to_es/ARESETN] [get_bd_pins connect_to_es/M00_ARESETN] \
  [get_bd_pins connect_to_es/M01_ARESETN] [get_bd_pins connect_to_es/M02_ARESETN] [get_bd_pins connect_to_es/S00_ARESETN] \
  [get_bd_pins connect_to_es/S01_ARESETN] [get_bd_pins connect_to_es_cu/ARESETN] [get_bd_pins connect_to_es_cu/M00_ARESETN] \
  [get_bd_pins connect_to_es_cu/M01_ARESETN] [get_bd_pins connect_to_es_cu/M02_ARESETN] \
  [get_bd_pins connect_to_es_cu/M03_ARESETN] [get_bd_pins connect_to_es_cu/S00_ARESETN] \
  [get_bd_pins connect_to_es_cu/S01_ARESETN] [get_bd_pins connect_to_es_cu/S02_ARESETN] \
  [get_bd_pins connect_to_es_cu/S03_ARESETN] [get_bd_pins embedded_schedular/reset_n] \
  [get_bd_pins sim_xdma_0/m_axictrl_aresetn] [get_bd_pins sim_xdma_0/m_aximm_aresetn]

current_bd_instance /static_region/clk_reset_wizard
connect_bd_net [get_bd_pins ddr0_ui_clk/clk] [get_bd_pins ddr_default_clk]
connect_bd_net [get_bd_pins ddr0_ui_clk/sync_rst] [get_bd_pins ddr_default_rst]
connect_bd_net [get_bd_pins kernel2_clk/sync_rst] [get_bd_pins clkwiz_kernel2_rst]
connect_bd_net [get_bd_pins kernel_clk/sync_rst] [get_bd_pins clkwiz_kernel_rst]
connect_bd_net [get_bd_pins kernel_clk/clk] [get_bd_pins clkwiz_kernel_clk]
connect_bd_net [get_bd_pins kernel2_clk/clk] [get_bd_pins clkwiz_kernel2_clk]

current_bd_instance /static_region/embedded_schedular
connect_bd_intf_net -intf_net S01_AXI_1 [get_bd_intf_pins m_axi_CQDma] [get_bd_intf_pins CuDmaController_0/m_axi_CQDma]
connect_bd_intf_net [get_bd_intf_pins m_axi_CUDma_0] [get_bd_intf_pins CuDmaController_0/m_axi_CUDma]
connect_bd_intf_net -intf_net axi_interconnect_0_M00_AXI [get_bd_intf_pins host] [get_bd_intf_pins embedded_scheduler_hw_0/host]
connect_bd_intf_net [get_bd_intf_pins SAXI] [get_bd_intf_pins sim_embedded_scheduler_sw_0/saxi_lite_cq]
connect_bd_intf_net [get_bd_intf_pins m_axi_a] [get_bd_intf_pins cuisr_0/m_axi_a]
connect_bd_intf_net [get_bd_intf_pins s_axi_0] [get_bd_intf_pins axi_intc_0/s_axi]
connect_bd_intf_net [get_bd_intf_pins MAXI] [get_bd_intf_pins sim_embedded_scheduler_sw_0/maxi_lite_mb]
connect_bd_net [get_bd_pins CuDmaController_0/ap_done] [get_bd_pins embedded_scheduler_hw_0/ap_done_cudma]
connect_bd_net [get_bd_pins axi_intc_0/irq] [get_bd_pins sim_embedded_scheduler_sw_0/irq]
connect_bd_net [get_bd_pins cuisr_0/ap_done] [get_bd_pins embedded_scheduler_hw_0/ap_done_cuisr]
connect_bd_net -net dma_pcie_aclk_clk [get_bd_pins clk] \
  [get_bd_pins CuDmaController_0/ap_clk] [get_bd_pins axi_intc_0/s_axi_aclk] [get_bd_pins cuisr_0/ap_clk] \
  [get_bd_pins embedded_scheduler_hw_0/clk] [get_bd_pins sim_embedded_scheduler_sw_0/maxi_lite_mb_aclk] \
  [get_bd_pins sim_embedded_scheduler_sw_0/saxi_lite_cq_aclk]
connect_bd_net -net dma_pcie_aclk_sync_rst [get_bd_pins reset_n] \
  [get_bd_pins CuDmaController_0/ap_rst_n] [get_bd_pins axi_intc_0/s_axi_aresetn] [get_bd_pins cuisr_0/ap_rst_n] \
  [get_bd_pins embedded_scheduler_hw_0/reset_n] [get_bd_pins sim_embedded_scheduler_sw_0/maxi_lite_mb_aresetn] \
  [get_bd_pins sim_embedded_scheduler_sw_0/saxi_lite_cq_aresetn]
connect_bd_net [get_bd_pins embedded_scheduler_hw_0/CqBaseAddress] [get_bd_pins CuDmaController_0/CqBaseAddress]
connect_bd_net [get_bd_pins embedded_scheduler_hw_0/CqDmaQueue_reg] [get_bd_pins CuDmaController_0/CuDmaQueue]
connect_bd_net [get_bd_pins embedded_scheduler_hw_0/CuBaseAddress] [get_bd_pins CuDmaController_0/CuBaseAddress]
connect_bd_net [get_bd_pins embedded_scheduler_hw_0/CuOffset] [get_bd_pins CuDmaController_0/CuOffset]
connect_bd_net [get_bd_pins embedded_scheduler_hw_0/NoofSlots] [get_bd_pins CuDmaController_0/NoOfSlots]
connect_bd_net [get_bd_pins embedded_scheduler_hw_0/SlotSize] [get_bd_pins CuDmaController_0/SlotSize]
connect_bd_net -net embedded_scheduler_hw_0_ap_offset_cuisr [get_bd_pins embedded_scheduler_hw_0/Offset] [get_bd_pins cuisr_0/Offset]
connect_bd_net [get_bd_pins embedded_scheduler_hw_0/ap_start_cudma] [get_bd_pins CuDmaController_0/ap_start]
connect_bd_net [get_bd_pins embedded_scheduler_hw_0/ap_start_cuisr] [get_bd_pins cuisr_0/ap_start]
connect_bd_net [get_bd_pins embedded_scheduler_hw_0/irq_cu_completion] [get_bd_pins xlconcat_0/In1]
connect_bd_net [get_bd_pins embedded_scheduler_hw_0/irq_slotavailable] [get_bd_pins xlconcat_0/In0]
connect_bd_net [get_bd_pins irq_cu] [get_bd_pins embedded_scheduler_hw_0/irq_cu]
connect_bd_net [get_bd_pins xlconcat_0/dout] [get_bd_pins axi_intc_0/intr]
connect_bd_net [get_bd_pins xlconstant_0/dout] [get_bd_pins embedded_scheduler_hw_0/irq_ack]

current_bd_instance /slr0
connect_bd_intf_net -intf_net interconnect_axilite_0_M00_AXI [get_bd_intf_pins interconnect_axilite_user_0/M00_AXI] [get_bd_intf_pins to_delete_kernel_ctrl_0/S00_AXI]
connect_bd_intf_net -intf_net xtlm_simple_intercon_0_ICN_S_AXI_0_AXI [get_bd_intf_pins S00_AXI] [get_bd_intf_pins icn_pass_0/S00_AXI]
connect_bd_intf_net -intf_net xtlm_simple_intercon_0_ICN_M_AXI_0_AXI [get_bd_intf_pins M00_AXI] [get_bd_intf_pins icn_pass_0/M00_AXI]
connect_bd_intf_net [get_bd_intf_pins S00_AXI1] [get_bd_intf_pins interconnect_axilite_user_0/S00_AXI]
connect_bd_net -net ui_clk_clk [get_bd_pins m00_axi_aclk] [get_bd_pins icn_pass_0/m00_axi_aclk] [get_bd_pins icn_pass_0/s00_axi_aclk]
connect_bd_net -net ui_clk_sync_rst [get_bd_pins m00_axi_aresetn] [get_bd_pins icn_pass_0/m00_axi_aresetn] [get_bd_pins icn_pass_0/s00_axi_aresetn]
connect_bd_net -net slowest_sync_clk_0_1 [get_bd_pins slowest_sync_clk] [get_bd_pins psr_kernel_clk_0/slowest_sync_clk]
connect_bd_net -net ext_reset_in_0_1 [get_bd_pins ext_reset_in] [get_bd_pins psr_kernel_clk_0/ext_reset_in]
connect_bd_net -net slowest_sync_clk_2_1 [get_bd_pins slowest_sync_clk1] [get_bd_pins psr_kernel2_clk_0/slowest_sync_clk]
connect_bd_net -net ext_reset_in_2_1 [get_bd_pins ext_reset_in1] [get_bd_pins psr_kernel2_clk_0/ext_reset_in]
connect_bd_net -net slowest_sync_clk_1_1 [get_bd_pins s00_axi_aclk] \
  [get_bd_pins to_delete_kernel_ctrl_0/s00_axi_aclk] [get_bd_pins interconnect_axilite_user_0/M00_ACLK] \
  [get_bd_pins interconnect_axilite_user_0/S00_ACLK] [get_bd_pins interconnect_axilite_user_0/ACLK]
connect_bd_net -net ext_reset_in_1_1 [get_bd_pins M00_ARESETN] \
  [get_bd_pins interconnect_axilite_user_0/M00_ARESETN] [get_bd_pins interconnect_axilite_user_0/S00_ARESETN] \
  [get_bd_pins to_delete_kernel_ctrl_0/s00_axi_aresetn] [get_bd_pins interconnect_axilite_user_0/ARESETN]

current_bd_instance /slr1
connect_bd_intf_net -intf_net interconnect_axilite_1_M00_AXI [get_bd_intf_pins interconnect_axilite_user_1/M00_AXI] [get_bd_intf_pins to_delete_kernel_ctrl_1/S00_AXI]
connect_bd_intf_net -intf_net xtlm_simple_intercon_0_ICN_M_AXI_2_AXI [get_bd_intf_pins M00_AXI1] [get_bd_intf_pins icn_pass_2/M00_AXI]
connect_bd_intf_net -intf_net xtlm_simple_intercon_0_ICN_S_AXI_2_AXI [get_bd_intf_pins S00_AXI1] [get_bd_intf_pins icn_pass_2/S00_AXI]
connect_bd_intf_net -intf_net xtlm_simple_intercon_0_ICN_M_AXI_1_AXI [get_bd_intf_pins M00_AXI] [get_bd_intf_pins icn_pass_1/M00_AXI]
connect_bd_intf_net -intf_net xtlm_simple_intercon_0_ICN_S_AXI_1_AXI [get_bd_intf_pins S00_AXI] [get_bd_intf_pins icn_pass_1/S00_AXI]
connect_bd_intf_net [get_bd_intf_pins S00_AXI2] [get_bd_intf_pins interconnect_axilite_user_1/S00_AXI]
connect_bd_net -net ui_clk_clk [get_bd_pins m00_axi_aclk] \
  [get_bd_pins icn_pass_1/m00_axi_aclk] [get_bd_pins icn_pass_2/m00_axi_aclk] [get_bd_pins icn_pass_2/s00_axi_aclk] \
  [get_bd_pins icn_pass_1/s00_axi_aclk]
connect_bd_net -net ui_clk_sync_rst [get_bd_pins m00_axi_aresetn] \
  [get_bd_pins icn_pass_1/m00_axi_aresetn] [get_bd_pins icn_pass_2/m00_axi_aresetn] [get_bd_pins icn_pass_2/s00_axi_aresetn] \
  [get_bd_pins icn_pass_1/s00_axi_aresetn]
connect_bd_net -net slowest_sync_clk_0_1 [get_bd_pins slowest_sync_clk] [get_bd_pins psr_kernel_clk_1/slowest_sync_clk]
connect_bd_net -net ext_reset_in_0_1 [get_bd_pins ext_reset_in] [get_bd_pins psr_kernel_clk_1/ext_reset_in]
connect_bd_net -net slowest_sync_clk_2_1 [get_bd_pins slowest_sync_clk1] [get_bd_pins psr_kernel2_clk_1/slowest_sync_clk]
connect_bd_net -net ext_reset_in_2_1 [get_bd_pins ext_reset_in1] [get_bd_pins psr_kernel2_clk_1/ext_reset_in]
connect_bd_net -net slowest_sync_clk_1_1 [get_bd_pins s00_axi_aclk] \
  [get_bd_pins to_delete_kernel_ctrl_1/s00_axi_aclk] [get_bd_pins interconnect_axilite_user_1/M00_ACLK] \
  [get_bd_pins interconnect_axilite_user_1/S00_ACLK] [get_bd_pins interconnect_axilite_user_1/ACLK]
connect_bd_net -net ext_reset_in_1_1 [get_bd_pins M00_ARESETN] \
  [get_bd_pins interconnect_axilite_user_1/M00_ARESETN] [get_bd_pins interconnect_axilite_user_1/S00_ARESETN] \
  [get_bd_pins to_delete_kernel_ctrl_1/s00_axi_aresetn] [get_bd_pins interconnect_axilite_user_1/ARESETN]

current_bd_instance /slr2
connect_bd_intf_net -intf_net xtlm_simple_intercon_0_ICN_S_AXI_3_AXI [get_bd_intf_pins S00_AXI] [get_bd_intf_pins icn_pass_3/S00_AXI]
connect_bd_intf_net -intf_net xtlm_simple_intercon_0_ICN_M_AXI_3_AXI [get_bd_intf_pins M00_AXI] [get_bd_intf_pins icn_pass_3/M00_AXI]
connect_bd_intf_net [get_bd_intf_pins S00_AXI1] [get_bd_intf_pins interconnect_axilite_user_2/S00_AXI]
connect_bd_intf_net -intf_net interconnect_axilite_2_M00_AXI [get_bd_intf_pins interconnect_axilite_user_2/M00_AXI] [get_bd_intf_pins to_delete_kernel_ctrl_2/S00_AXI]
connect_bd_net -net ui_clk_clk [get_bd_pins m00_axi_aclk] [get_bd_pins icn_pass_3/m00_axi_aclk] [get_bd_pins icn_pass_3/s00_axi_aclk]
connect_bd_net -net ui_clk_sync_rst [get_bd_pins m00_axi_aresetn] [get_bd_pins icn_pass_3/m00_axi_aresetn] [get_bd_pins icn_pass_3/s00_axi_aresetn]
connect_bd_net -net slowest_sync_clk_0_1 [get_bd_pins slowest_sync_clk] [get_bd_pins psr_kernel_clk_2/slowest_sync_clk]
connect_bd_net -net ext_reset_in_0_1 [get_bd_pins ext_reset_in] [get_bd_pins psr_kernel_clk_2/ext_reset_in]
connect_bd_net -net slowest_sync_clk_2_1 [get_bd_pins slowest_sync_clk1] [get_bd_pins psr_kernel2_clk_2/slowest_sync_clk]
connect_bd_net -net ext_reset_in_2_1 [get_bd_pins ext_reset_in1] [get_bd_pins psr_kernel2_clk_2/ext_reset_in]
connect_bd_net -net slowest_sync_clk_1_1 [get_bd_pins s00_axi_aclk] \
  [get_bd_pins to_delete_kernel_ctrl_2/s00_axi_aclk] [get_bd_pins interconnect_axilite_user_2/M00_ACLK] \
  [get_bd_pins interconnect_axilite_user_2/S00_ACLK] [get_bd_pins interconnect_axilite_user_2/ACLK]
connect_bd_net -net ext_reset_in_1_1 [get_bd_pins M00_ARESETN] \
  [get_bd_pins interconnect_axilite_user_2/M00_ARESETN] [get_bd_pins interconnect_axilite_user_2/S00_ARESETN] \
  [get_bd_pins to_delete_kernel_ctrl_2/s00_axi_aresetn] [get_bd_pins interconnect_axilite_user_2/ARESETN]

current_bd_instance /interrupt_concat
connect_bd_net -net In0_1 [get_bd_pins In0] [get_bd_pins xlconcat_interrupt_0/In0]
connect_bd_net [get_bd_pins xlconcat_interrupt_0/dout] [get_bd_pins xlconcat_interrupt/In0]
connect_bd_net [get_bd_pins xlconcat_interrupt_1/dout] [get_bd_pins xlconcat_interrupt/In1]
connect_bd_net [get_bd_pins xlconcat_interrupt_2/dout] [get_bd_pins xlconcat_interrupt/In2]
connect_bd_net [get_bd_pins xlconcat_interrupt_3/dout] [get_bd_pins xlconcat_interrupt/In3]
connect_bd_net [get_bd_pins xlconcat_interrupt/dout] [get_bd_pins xlconcat_interrupt_dout]
connect_bd_net [get_bd_pins xlconstant_gnd/dout] \
  [get_bd_pins xlconcat_interrupt_0/In1] [get_bd_pins xlconcat_interrupt_0/In2] [get_bd_pins xlconcat_interrupt_0/In3] \
  [get_bd_pins xlconcat_interrupt_0/In4] [get_bd_pins xlconcat_interrupt_0/In5] [get_bd_pins xlconcat_interrupt_0/In6] \
  [get_bd_pins xlconcat_interrupt_0/In7] [get_bd_pins xlconcat_interrupt_0/In8] [get_bd_pins xlconcat_interrupt_0/In9] \
  [get_bd_pins xlconcat_interrupt_0/In10] [get_bd_pins xlconcat_interrupt_0/In11] [get_bd_pins xlconcat_interrupt_0/In12] \
  [get_bd_pins xlconcat_interrupt_0/In13] [get_bd_pins xlconcat_interrupt_0/In14] [get_bd_pins xlconcat_interrupt_0/In15] \
  [get_bd_pins xlconcat_interrupt_0/In16] [get_bd_pins xlconcat_interrupt_0/In17] [get_bd_pins xlconcat_interrupt_0/In18] \
  [get_bd_pins xlconcat_interrupt_0/In19] [get_bd_pins xlconcat_interrupt_0/In20] [get_bd_pins xlconcat_interrupt_0/In21] \
  [get_bd_pins xlconcat_interrupt_0/In22] [get_bd_pins xlconcat_interrupt_0/In23] [get_bd_pins xlconcat_interrupt_0/In24] \
  [get_bd_pins xlconcat_interrupt_0/In25] [get_bd_pins xlconcat_interrupt_0/In26] [get_bd_pins xlconcat_interrupt_0/In27] \
  [get_bd_pins xlconcat_interrupt_0/In28] [get_bd_pins xlconcat_interrupt_0/In29] [get_bd_pins xlconcat_interrupt_0/In30] \
  [get_bd_pins xlconcat_interrupt_0/In31] [get_bd_pins xlconcat_interrupt_1/In0] [get_bd_pins xlconcat_interrupt_1/In1] \
  [get_bd_pins xlconcat_interrupt_1/In2] [get_bd_pins xlconcat_interrupt_1/In3] [get_bd_pins xlconcat_interrupt_1/In4] \
  [get_bd_pins xlconcat_interrupt_1/In5] [get_bd_pins xlconcat_interrupt_1/In6] [get_bd_pins xlconcat_interrupt_1/In7] \
  [get_bd_pins xlconcat_interrupt_1/In8] [get_bd_pins xlconcat_interrupt_1/In9] [get_bd_pins xlconcat_interrupt_1/In10] \
  [get_bd_pins xlconcat_interrupt_1/In11] [get_bd_pins xlconcat_interrupt_1/In12] [get_bd_pins xlconcat_interrupt_1/In13] \
  [get_bd_pins xlconcat_interrupt_1/In14] [get_bd_pins xlconcat_interrupt_1/In15] [get_bd_pins xlconcat_interrupt_1/In16] \
  [get_bd_pins xlconcat_interrupt_1/In17] [get_bd_pins xlconcat_interrupt_1/In18] [get_bd_pins xlconcat_interrupt_1/In19] \
  [get_bd_pins xlconcat_interrupt_1/In20] [get_bd_pins xlconcat_interrupt_1/In21] [get_bd_pins xlconcat_interrupt_1/In22] \
  [get_bd_pins xlconcat_interrupt_1/In23] [get_bd_pins xlconcat_interrupt_1/In24] [get_bd_pins xlconcat_interrupt_1/In25] \
  [get_bd_pins xlconcat_interrupt_1/In26] [get_bd_pins xlconcat_interrupt_1/In27] [get_bd_pins xlconcat_interrupt_1/In28] \
  [get_bd_pins xlconcat_interrupt_1/In29] [get_bd_pins xlconcat_interrupt_1/In30] [get_bd_pins xlconcat_interrupt_1/In31] \
  [get_bd_pins xlconcat_interrupt_2/In0] [get_bd_pins xlconcat_interrupt_2/In1] [get_bd_pins xlconcat_interrupt_2/In2] \
  [get_bd_pins xlconcat_interrupt_2/In3] [get_bd_pins xlconcat_interrupt_2/In4] [get_bd_pins xlconcat_interrupt_2/In5] \
  [get_bd_pins xlconcat_interrupt_2/In6] [get_bd_pins xlconcat_interrupt_2/In7] [get_bd_pins xlconcat_interrupt_2/In8] \
  [get_bd_pins xlconcat_interrupt_2/In9] [get_bd_pins xlconcat_interrupt_2/In10] [get_bd_pins xlconcat_interrupt_2/In11] \
  [get_bd_pins xlconcat_interrupt_2/In12] [get_bd_pins xlconcat_interrupt_2/In13] [get_bd_pins xlconcat_interrupt_2/In14] \
  [get_bd_pins xlconcat_interrupt_2/In15] [get_bd_pins xlconcat_interrupt_2/In16] [get_bd_pins xlconcat_interrupt_2/In17] \
  [get_bd_pins xlconcat_interrupt_2/In18] [get_bd_pins xlconcat_interrupt_2/In19] [get_bd_pins xlconcat_interrupt_2/In20] \
  [get_bd_pins xlconcat_interrupt_2/In21] [get_bd_pins xlconcat_interrupt_2/In22] [get_bd_pins xlconcat_interrupt_2/In23] \
  [get_bd_pins xlconcat_interrupt_2/In24] [get_bd_pins xlconcat_interrupt_2/In25] [get_bd_pins xlconcat_interrupt_2/In26] \
  [get_bd_pins xlconcat_interrupt_2/In27] [get_bd_pins xlconcat_interrupt_2/In28] [get_bd_pins xlconcat_interrupt_2/In29] \
  [get_bd_pins xlconcat_interrupt_2/In30] [get_bd_pins xlconcat_interrupt_2/In31] [get_bd_pins xlconcat_interrupt_3/In0] \
  [get_bd_pins xlconcat_interrupt_3/In1] [get_bd_pins xlconcat_interrupt_3/In2] [get_bd_pins xlconcat_interrupt_3/In3] \
  [get_bd_pins xlconcat_interrupt_3/In4] [get_bd_pins xlconcat_interrupt_3/In5] [get_bd_pins xlconcat_interrupt_3/In6] \
  [get_bd_pins xlconcat_interrupt_3/In7] [get_bd_pins xlconcat_interrupt_3/In8] [get_bd_pins xlconcat_interrupt_3/In9] \
  [get_bd_pins xlconcat_interrupt_3/In10] [get_bd_pins xlconcat_interrupt_3/In11] [get_bd_pins xlconcat_interrupt_3/In12] \
  [get_bd_pins xlconcat_interrupt_3/In13] [get_bd_pins xlconcat_interrupt_3/In14] [get_bd_pins xlconcat_interrupt_3/In15] \
  [get_bd_pins xlconcat_interrupt_3/In16] [get_bd_pins xlconcat_interrupt_3/In17] [get_bd_pins xlconcat_interrupt_3/In18] \
  [get_bd_pins xlconcat_interrupt_3/In19] [get_bd_pins xlconcat_interrupt_3/In20] [get_bd_pins xlconcat_interrupt_3/In21] \
  [get_bd_pins xlconcat_interrupt_3/In22] [get_bd_pins xlconcat_interrupt_3/In23] [get_bd_pins xlconcat_interrupt_3/In24] \
  [get_bd_pins xlconcat_interrupt_3/In25] [get_bd_pins xlconcat_interrupt_3/In26] [get_bd_pins xlconcat_interrupt_3/In27] \
  [get_bd_pins xlconcat_interrupt_3/In28] [get_bd_pins xlconcat_interrupt_3/In29] [get_bd_pins xlconcat_interrupt_3/In30] \
  [get_bd_pins xlconcat_interrupt_3/In31]

current_bd_instance /
connect_bd_intf_net [get_bd_intf_pins memory_subsystem/M00_AXI] [get_bd_intf_pins sim_ddr_0/C0_DDR_SAXI]
connect_bd_intf_net -intf_net xtlm_simple_intercon_0_ICN_S_AXI_0_AXI [get_bd_intf_pins slr0/S00_AXI] [get_bd_intf_pins xtlm_simple_intercon_0/M00_AXI]
connect_bd_intf_net -intf_net xtlm_simple_intercon_0_ICN_M_AXI_0_AXI [get_bd_intf_pins memory_subsystem/S00_AXI] [get_bd_intf_pins slr0/M00_AXI]
connect_bd_intf_net [get_bd_intf_pins memory_subsystem/M02_AXI] [get_bd_intf_pins sim_ddr_2/C0_DDR_SAXI]
connect_bd_intf_net -intf_net xtlm_simple_intercon_0_ICN_M_AXI_3_AXI [get_bd_intf_pins memory_subsystem/S03_AXI] [get_bd_intf_pins slr2/M00_AXI]
connect_bd_intf_net -intf_net xtlm_simple_intercon_0_ICN_S_AXI_3_AXI [get_bd_intf_pins slr2/S00_AXI] [get_bd_intf_pins xtlm_simple_intercon_0/M03_AXI]
connect_bd_intf_net [get_bd_intf_pins slr0/S00_AXI1] [get_bd_intf_pins static_region/userpf_control_M_AXI_slr0]
connect_bd_intf_net [get_bd_intf_pins xtlm_simple_intercon_0/S00_AXI] [get_bd_intf_pins static_region/data_M_AXI_0]
connect_bd_intf_net [get_bd_intf_pins slr2/S00_AXI1] [get_bd_intf_pins static_region/userpf_control_M_AXI_slr2]
connect_bd_intf_net [get_bd_intf_pins slr1/S00_AXI2] [get_bd_intf_pins static_region/userpf_control_M_AXI_slr1]
connect_bd_intf_net [get_bd_intf_pins memory_subsystem/M03_AXI] [get_bd_intf_pins sim_ddr_3/C0_DDR_SAXI]
connect_bd_intf_net -intf_net xtlm_simple_intercon_0_ICN_M_AXI_2_AXI [get_bd_intf_pins memory_subsystem/S02_AXI] [get_bd_intf_pins slr1/M00_AXI1]
connect_bd_intf_net -intf_net xtlm_simple_intercon_0_ICN_S_AXI_2_AXI [get_bd_intf_pins slr1/S00_AXI1] [get_bd_intf_pins xtlm_simple_intercon_0/M02_AXI]
connect_bd_intf_net -intf_net xtlm_simple_intercon_0_ICN_S_AXI_1_AXI [get_bd_intf_pins slr1/S00_AXI] [get_bd_intf_pins xtlm_simple_intercon_0/M01_AXI]
connect_bd_intf_net [get_bd_intf_pins memory_subsystem/M01_AXI] [get_bd_intf_pins static_region/C0_DDR_SAXI_0]
connect_bd_intf_net -intf_net xtlm_simple_intercon_0_ICN_M_AXI_1_AXI [get_bd_intf_pins memory_subsystem/S01_AXI] [get_bd_intf_pins slr1/M00_AXI]
connect_bd_net -net ext_reset_in_0_1 [get_bd_pins kernel_clk/sync_rst] \
  [get_bd_pins slr0/ext_reset_in] [get_bd_pins slr1/ext_reset_in] [get_bd_pins slr2/ext_reset_in]
connect_bd_net -net ext_reset_in_1_1 [get_bd_pins static_region/dma_pcie_arst] \
  [get_bd_pins xtlm_simple_intercon_0/s00_axi_aresetn] [get_bd_pins slr0/M00_ARESETN] [get_bd_pins slr1/M00_ARESETN] \
  [get_bd_pins slr2/M00_ARESETN]
connect_bd_net -net ext_reset_in_2_1 [get_bd_pins kernel2_clk/sync_rst] \
  [get_bd_pins slr0/ext_reset_in1] [get_bd_pins slr1/ext_reset_in1] [get_bd_pins slr2/ext_reset_in1]
connect_bd_net -net slowest_sync_clk_0_1 [get_bd_pins kernel_clk/clk] \
  [get_bd_pins slr0/slowest_sync_clk] [get_bd_pins slr1/slowest_sync_clk] [get_bd_pins slr2/slowest_sync_clk]
connect_bd_net -net slowest_sync_clk_1_1 [get_bd_pins static_region/dma_pcie_aclk] \
  [get_bd_pins xtlm_simple_intercon_0/s00_axi_aclk] [get_bd_pins slr0/s00_axi_aclk] [get_bd_pins slr1/s00_axi_aclk] \
  [get_bd_pins slr2/s00_axi_aclk]
connect_bd_net -net slowest_sync_clk_2_1 [get_bd_pins kernel2_clk/clk] \
  [get_bd_pins slr0/slowest_sync_clk1] [get_bd_pins slr1/slowest_sync_clk1] [get_bd_pins slr2/slowest_sync_clk1]
connect_bd_net -net ui_clk_clk [get_bd_pins static_region/ddr_default_clk_0] \
  [get_bd_pins memory_subsystem/aclk] [get_bd_pins xtlm_simple_intercon_0/m00_axi_aclk] \
  [get_bd_pins xtlm_simple_intercon_0/m01_axi_aclk] [get_bd_pins xtlm_simple_intercon_0/m02_axi_aclk] \
  [get_bd_pins xtlm_simple_intercon_0/m03_axi_aclk] [get_bd_pins sim_ddr_0/c0_ddr_saxi_aclk] \
  [get_bd_pins sim_ddr_0/c0_ui_clk] [get_bd_pins sim_ddr_0/s_xdma_axi_aclk] [get_bd_pins sim_ddr_2/c0_ddr_saxi_aclk] \
  [get_bd_pins sim_ddr_2/c0_ui_clk] [get_bd_pins sim_ddr_2/s_xdma_axi_aclk] [get_bd_pins sim_ddr_3/c0_ddr_saxi_aclk] \
  [get_bd_pins sim_ddr_3/c0_ui_clk] [get_bd_pins sim_ddr_3/s_xdma_axi_aclk] [get_bd_pins slr0/m00_axi_aclk] \
  [get_bd_pins slr1/m00_axi_aclk] [get_bd_pins slr2/m00_axi_aclk]
connect_bd_net -net ui_clk_sync_rst [get_bd_pins static_region/ddr_default_rst_0] \
  [get_bd_pins memory_subsystem/aresetn] [get_bd_pins xtlm_simple_intercon_0/m00_axi_aresetn] \
  [get_bd_pins xtlm_simple_intercon_0/m01_axi_aresetn] [get_bd_pins xtlm_simple_intercon_0/m02_axi_aresetn] \
  [get_bd_pins xtlm_simple_intercon_0/m03_axi_aresetn] [get_bd_pins sim_ddr_0/c0_ddr_saxi_aresetn] \
  [get_bd_pins sim_ddr_0/s_xdma_axi_aresetn] [get_bd_pins sim_ddr_2/c0_ddr_saxi_aresetn] \
  [get_bd_pins sim_ddr_2/s_xdma_axi_aresetn] [get_bd_pins sim_ddr_3/c0_ddr_saxi_aresetn] \
  [get_bd_pins sim_ddr_3/s_xdma_axi_aresetn] [get_bd_pins slr0/m00_axi_aresetn] [get_bd_pins slr1/m00_axi_aresetn] \
  [get_bd_pins slr2/m00_axi_aresetn]
connect_bd_net -net irq_cu_1 [get_bd_pins interrupt_concat/xlconcat_interrupt_dout] [get_bd_pins static_region/irq_cu]
